# EAGLE design TSL238_breakout (EAGLE 7.7.0)
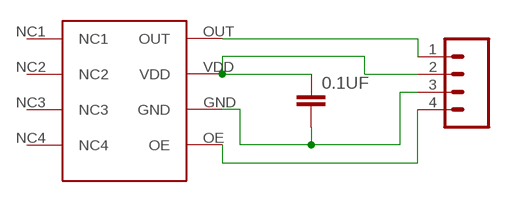
[diagram p0: schematic, sheet 1]

## Parts
0.1UF  CAP0603-CAP  [0603-CAP]
J1  M04PTH  [1X04]
U$1  TSL238  [TSL238]

## Nets
GND: 0.1UF.2 J1.3 U$1.GND
OE: J1.4 U$1.OE
OUT: J1.1 U$1.OUT
VCC: 0.1UF.1 J1.2 U$1.VDD
Unconnected: U$1.NC1 U$1.NC2 U$1.NC3 U$1.NC4

## Library data of the parts
0.1UF = SparkFun-Capacitors:CAP: Capacitor Standard 0603 ceramic capacitor, and 0.1" leaded capacitor.
J1 = SparkFun-Connectors:M04: Header 4 Standard 4-pin 0.1" header. Use with straight break away headers (SKU : PRT-00116), right angle break away headers (PRT-00553), swiss pins (PRT-00743), machine pins (PRT-00117), and female headers (PRT-00115). Molex polarized connector foot print use with SKU : PRT-08231 with associated crimp pins and housings. 1MM SMD Version SKU: PRT-10208; PROD_ID: CONN-09696
U$1 = awqua_eagle_library:TSL238

## Board
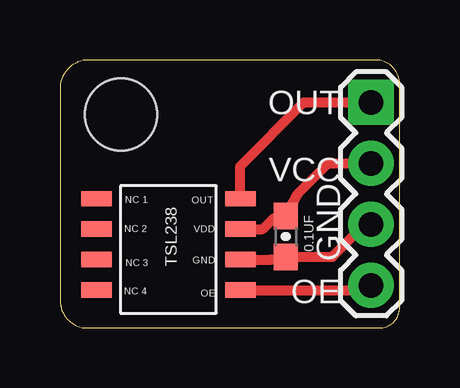
[diagram p1: board, top side]
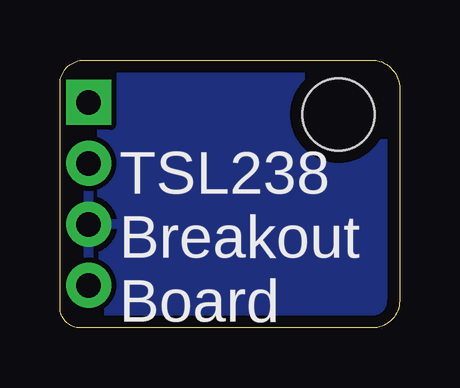
[diagram p2: board, bottom side, seen from below]

Size 14.15 x 11.17 mm. Coordinates in mm from the lower left corner, seen from the top.
Outline: 0.01,9.84 0.01,1.14 arc90 1.14,0 13.3,0 arc90 14.15,0.85 14.15,10.15 arc90 13.14,11.17 1.08,11.17 arc90 0.01,9.84
Copper layers (1*16): Top 0.035mm / dielectric 1.5mm / Bottom 0.035mm
Design rules "default *": minimum track width 10mil, minimum drill 24mil, track to track 8mil, track to pad 8mil, pad to pad 8mil, via to via 8mil, smd to smd 8mil, copper to edge 20mil, drill to drill 8mil, minimum pad ring 10mil, minimum via ring 8mil, stop-mask expansion 4mil, vias tented up to drill 0mil, thermal gap 10mil
Holes 3 mm at 2.55,8.89

### Footprints (pad centres in the part's own frame; a part is rotated, then mirrored left to right if it is on the bottom)
0603-CAP = smd 1.1 x 1: 1 -0.85,0; 2 0.85,0
1X04 = drill 1.016 pad 1.88 square: 1 0,0 | drill 1.016 pad 1.88: 2 2.54,0; 3 5.08,0; 4 7.62,0
TSL238 = smd 0.635 x 1.27: GND 2.23,3.19; NC1 -0.31,-2.81; NC2 0.96,-2.81; NC3 2.23,-2.81; NC4 3.5,-2.81; OE 3.5,3.19; OUT -0.31,3.19; VDD 0.96,3.19

### Placement (x,y rotation side)
0.1UF  9.4,3.81 270 top
J1  12.96,9.4 270 top
U$1  4.32,5.08 270 top

### Tracks (layer width: path | path; a pad name or v marks a point on that pad's centre or on a via)
GND
  Top 0.406: J1.3 12.71,4.06 12.45,4.06 11.35,2.96 0.1UF.2 8.79,2.85 U$1.GND
  pour Bottom: -3.55,13.72 18.04,13.72 18.04,-2.79 -3.55,-2.79
OE
  Top 0.406: U$1.OE 12.76,1.58 J1.4
OUT
  Top 0.406: U$1.OUT 7.51,6.75 10.17,9.4 J1.1
VCC
  Top 0.406: J1.2 11.18,6.86 9.91,5.59 0.1UF.1 9.06,4.57 8.9,4.57 8.44,4.12 U$1.VDD

### Text on the board
bPlace: TSL238 / Breakout / Board
tNames: OUT | VCC | GND | OE